# Altium schematic sheet Misc.SchDoc
size A3; DocumentNumber: 9; SheetNumber: 9; SheetTotal: 10; PageSetup: Record=PageOptions|CenterHorizontal=True|CenterVertical=True|PrintScale=0.97|XCorrection=1.00|YCorrection=1.00|PrintKind=1|BorderSize=5000000|LeftOffset=0|BottomOffset=0|Orientation=2|PaperLength=2970|PaperWidth=2100|Scale=100|PaperSource=7|PrintQuality=600|MediaType=1|DitherType=10|PaperKind=A4|PrintScaleMode=1
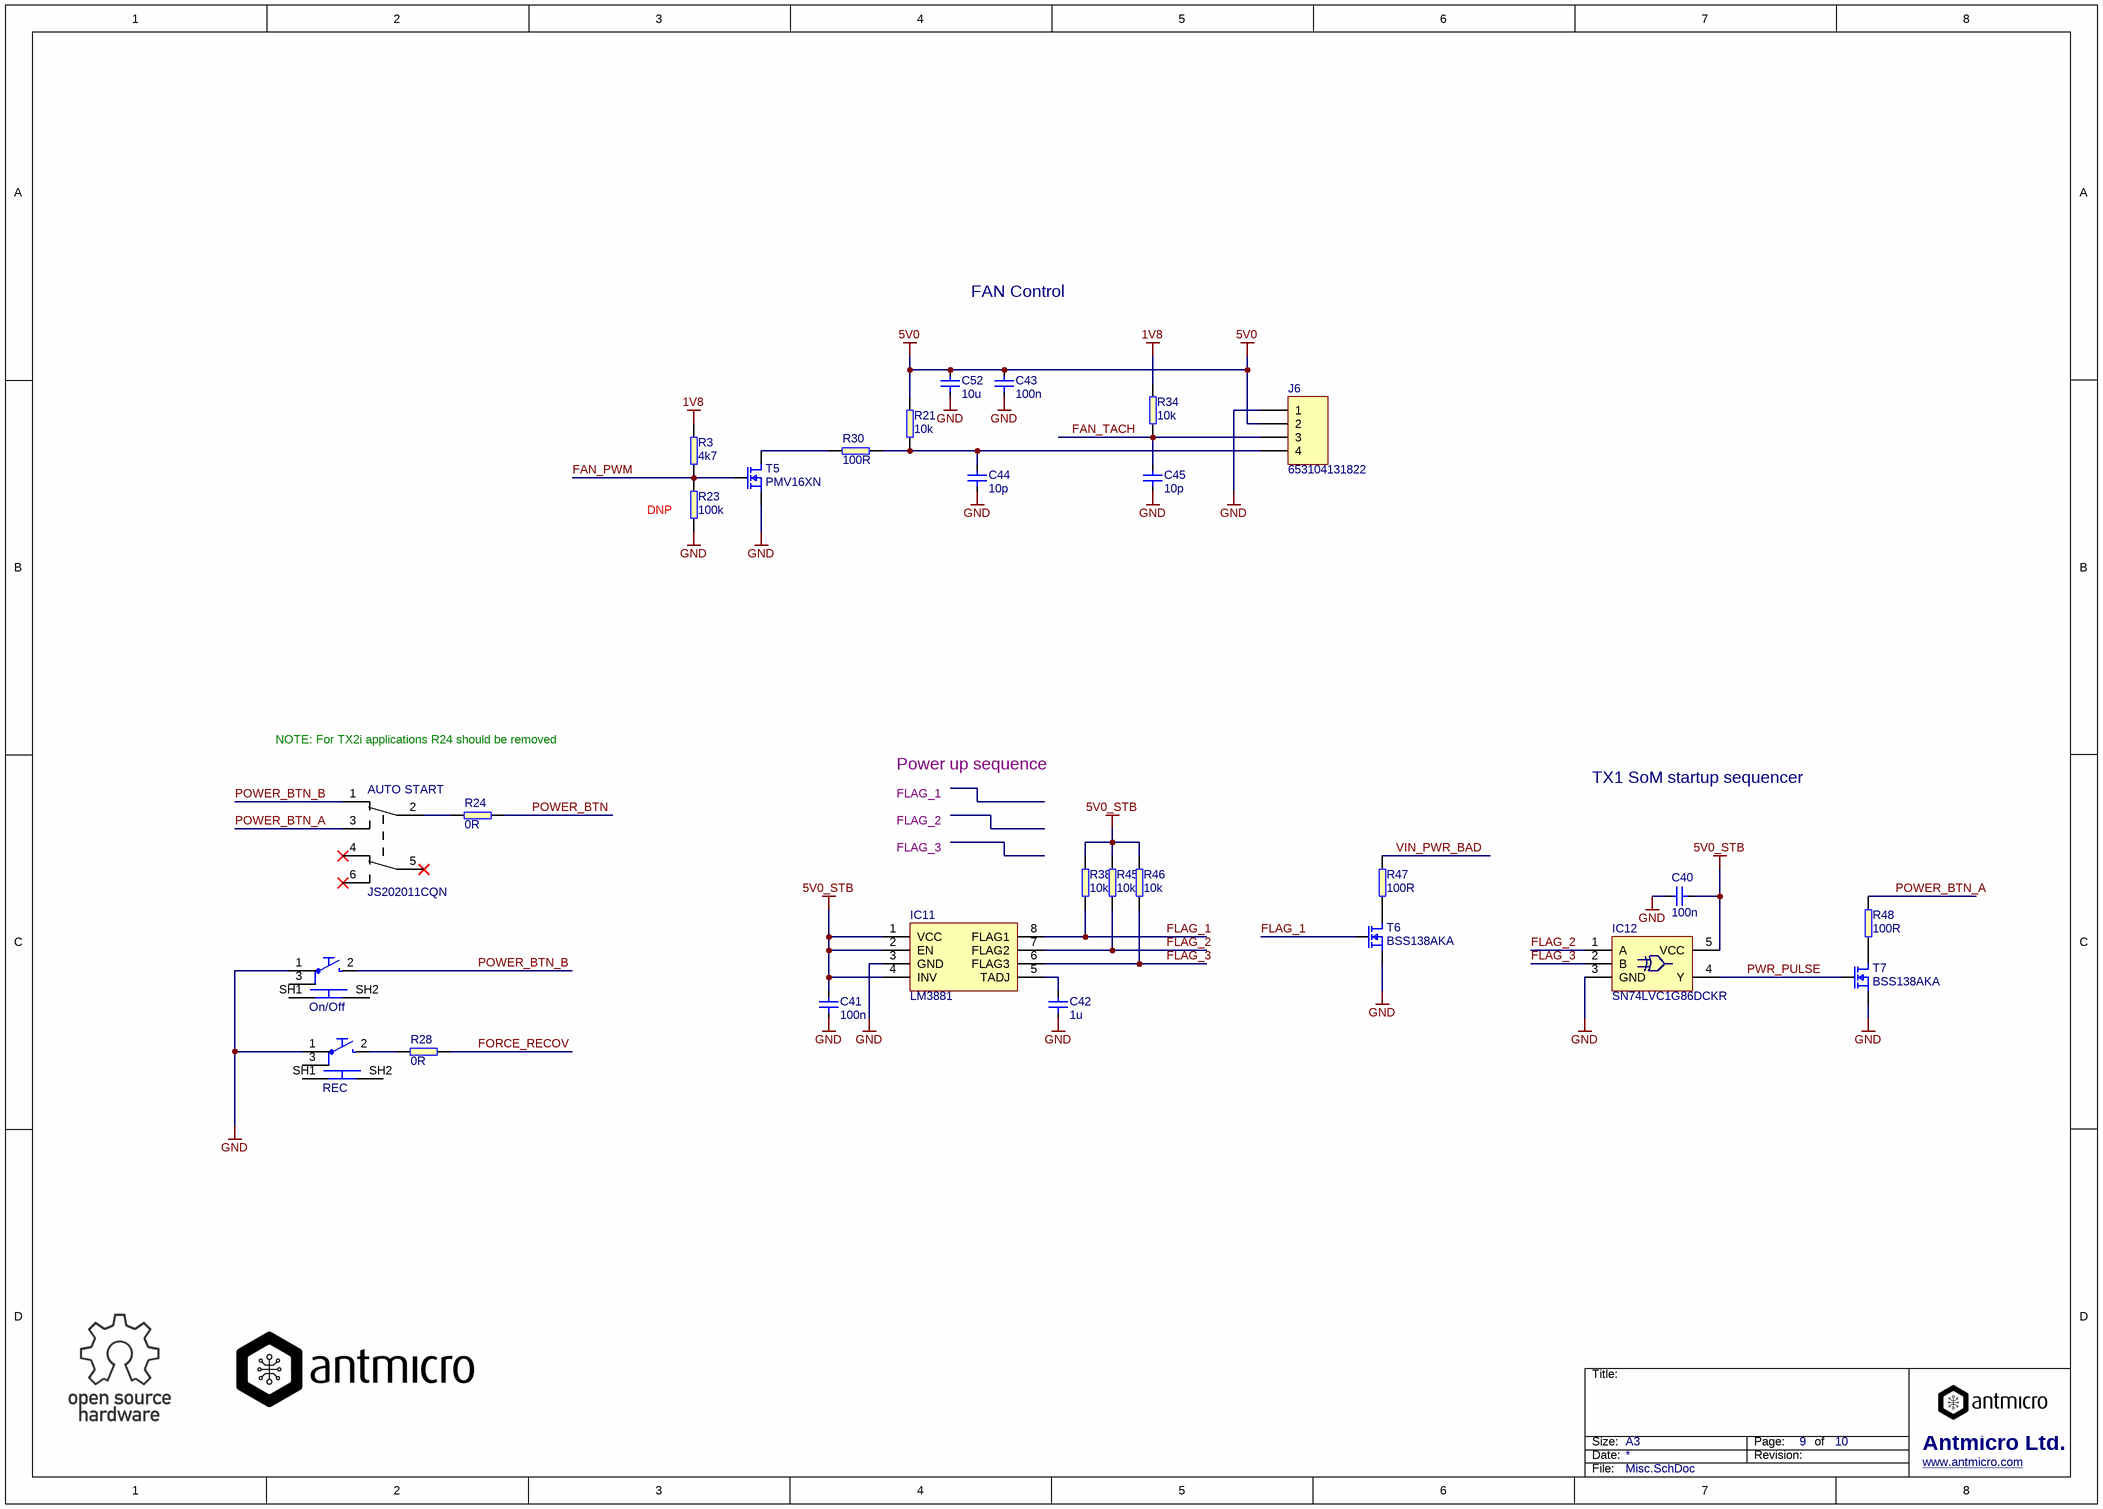
[diagram p0: Misc.SchDoc]

## Parts
AUTO_START  JS202011CQN  [JS202011CQN]
C40  100n  [0603]
C41  100n  [0603]
C42  1u  [0603]
C43  100n  [0603]
C44  10p  [0603]
C45  10p  [0603]
C52  10u  [0603]
IC11  LM3881  [MSOP-8]
IC12  SN74LVC1G86DCKR  [SC70-5]
J6  653104131822  [WE_653104131822]
On/Off  TL3340AF160QG  [TL3340AF160QG]  (value not drawn)
R3  4k7  [0603]
R21  10k  [0603]
R23  100k  [0603]
R24  0R  [0603]
R28  0R  [0603]
R30  100R  [0603]
R34  10k  [0603]
R38  10k  [0603]
R45  10k  [0603]
R46  10k  [0603]
R47  100R  [0603]
R48  100R  [0603]
REC  TL3340AF160QG  [TL3340AF160QG]  (value not drawn)
T5  PMV16XN  [SOT-23]
T6  BSS138AKA  [SOT-23]
T7  BSS138AKA  [SOT-23]

## Nets
1V8: R3.2 R34.2
5V0: C43.2 C52.2 J6.2 R21.2
5V0_STB: C40.1 C41.2 IC11.1(VCC) IC11.2(EN) IC11.4(INV) IC12.5(VCC) R38.2 R45.2 R46.2
GND: C40.2 C41.1 C42.1 C43.1 C44.1 C45.1 C52.1 IC11.3(GND) IC12.3(GND) J6.1 On/Off.1 R23.1 REC.1 T5.2(S) T6.2(S) T7.2(S)
FAN_PWM: R3.1 R23.2 T5.1(G)
FAN_TACH: C45.2 J6.3 R34.1
FLAG_1: IC11.8(FLAG1) R38.1 T6.1(G)
FLAG_2: IC11.7(FLAG2) IC12.1(A) R45.1
FLAG_3: IC11.6(FLAG3) IC12.2(B) R46.1
FORCE_RECOV: R28.2
POWER_BTN: R24.2
POWER_BTN_A: AUTO_START.3 R48.2
POWER_BTN_B: AUTO_START.1 On/Off.2
PWR_PULSE: IC12.4(Y) T7.1(G)
VIN_PWR_BAD: R47.2
NetAUTO_START_2: AUTO_START.2 R24.1
NetC42_2: C42.2 IC11.5(TADJ)
NetC44_2: C44.2 J6.4 R21.1 R30.2
NetR28_1: R28.1 REC.2
NetR30_1: R30.1 T5.3(D)
NetR47_1: R47.1 T6.3(D)
NetR48_1: R48.1 T7.3(D)

Not connected (* = marked no-connect by the designer): AUTO_START 4* 5* 6*; On/Off 3 SH1 SH2; REC 3 SH1 SH2

## Notes on the sheet
- FAN Control
- (near R23) DNP
- NOTE: For TX2i applications R24 should be removed
- Power up sequence
- TX1 SoM startup sequencer
- FLAG_1
- FLAG_2
- FLAG_3
- Title:
- Size:
- Date:
- A3
- Revision:
- Page:
- of
- Antmicro Ltd.
- File:
- www.antmicro.com

## Library data of the parts
AUTO_START = DPDT: Sub-Miniature Slide Switch; Manufacturer: C&K; Value: JS202011CQN; Part Symbol: JS202011CQN
C40 C41 C43 = C_100n_0603: MLCC SMT Capacitor 100nF 0603; Manufacturer: WALSIN; Part Symbol: 0603B104K500CT; Part Number: C_100n_0603; Value: 100n
C42 = C_1u_0603: MLCC SMT Capacitor 1uF 0603; Manufacturer: MULTICOMP; Part Symbol: MC0603X105M6R3CT; Part Number: C_1u_0603; Value: 1u
C44 C45 = C_10p_0603: MLCC SMT Capacitor 10pF 0603; Manufacturer: JOHANSON TECHNOLOGY; Part Symbol: 251R14S100GV4T; Value: 10p; Part Number: C_10p_0603
C52 = C_10u_0603: MLCC SMT Capacitor 10uF 0603; Manufacturer: MULTICOMP; Part Symbol: MC0603X106M6R3CT; Value: 10u; Part Number: C_10u_0603
IC11 = LM3881: TEXAS INSTRUMENTS  LM3881MME/NOPB  Power Sequencer, 3-Monitors, 2.7V-5.5Vin,VSSOP-8; Part Number: LM3881; Value: LM3881; Manufacturer: TEXAS INSTRUMENTS; Part Symbol: LM3881MME
IC12 = SN74LVC1G86: 2 input XOR gate; Manufacturer: Texas Instruments; Part Number: SN74LVC1G86DCKR; Value: SN74LVC1G86DCKR; Part Symbol: SN74LVC1G86DCKR
J6 = WE_653104131822: HEADER 4POS MALE HORIZ 1.25MM SMD; Manufacturer: WURTH ELEKTRONIK; Part Number: WE_653104131822; Value: 653104131822; Part Symbol: 653104131822
On/Off REC = TL3340AF160QG: E-SWITCH  TL3340AF160QG  SWITCH, TACTILE SPST 50mA, SMD GULL WING; Part Number: TL3340AF160QG; Value: TL3340AF160QG; Manufacturer: E-SWITCH; Part Symbol: TL3340AF160QG
R3 = R_4k7_0603: SMT Resistor 4k7 0603; Manufacturer: BOURNS; Part Symbol: CR0603-FX-4701ELF; Value: 4k7; Part Number: R_4k7_0603
R21 R34 R38 R45 R46 = R_10k_0603: SMT Resistor 10k 0603; Manufacturer: BOURNS; Part Symbol: CR0603-JW-103ELF; Value: 10k; Part Number: R_10k_0603
R23 = R_100k_0603: SMT Resistor 100k 0603; Manufacturer: BOURNS; Part Symbol: CR0603-JW-104GLF; Value: 100k; Part Number: R_100k_0603
R24 R28 = R_0R_0603: SMT Resistor 0R 0603; Manufacturer: BOURNS; Part Symbol: CR0603-J/-000ELF; Value: 0R; Part Number: R_0R_0603
R30 R47 R48 = R_100R_0603: SMT Resistor 100R 0603; Manufacturer: MULTICOMP; Part Symbol: MC0063W06035100R; Value: 100R; Part Number: R_100R_0603
T5 = PMV16XN: MOSFET Transistor, N Channel, 6.8 A, 20 V, 0.016 ohm, 4.5 V; Manufacturer: NXP; Value: PMV16XN; Part Number: PMV16XN; Part Symbol: PMV16XN
T6 T7 = BSS138: MOSFET, N CH, 60V, 0.2A; Part Number: BSS138; Manufacturer: NXP; Value: BSS138AKA; Part Symbol: BSS138AKA